# EAGLE design amp_board (EAGLE 9.6.0)
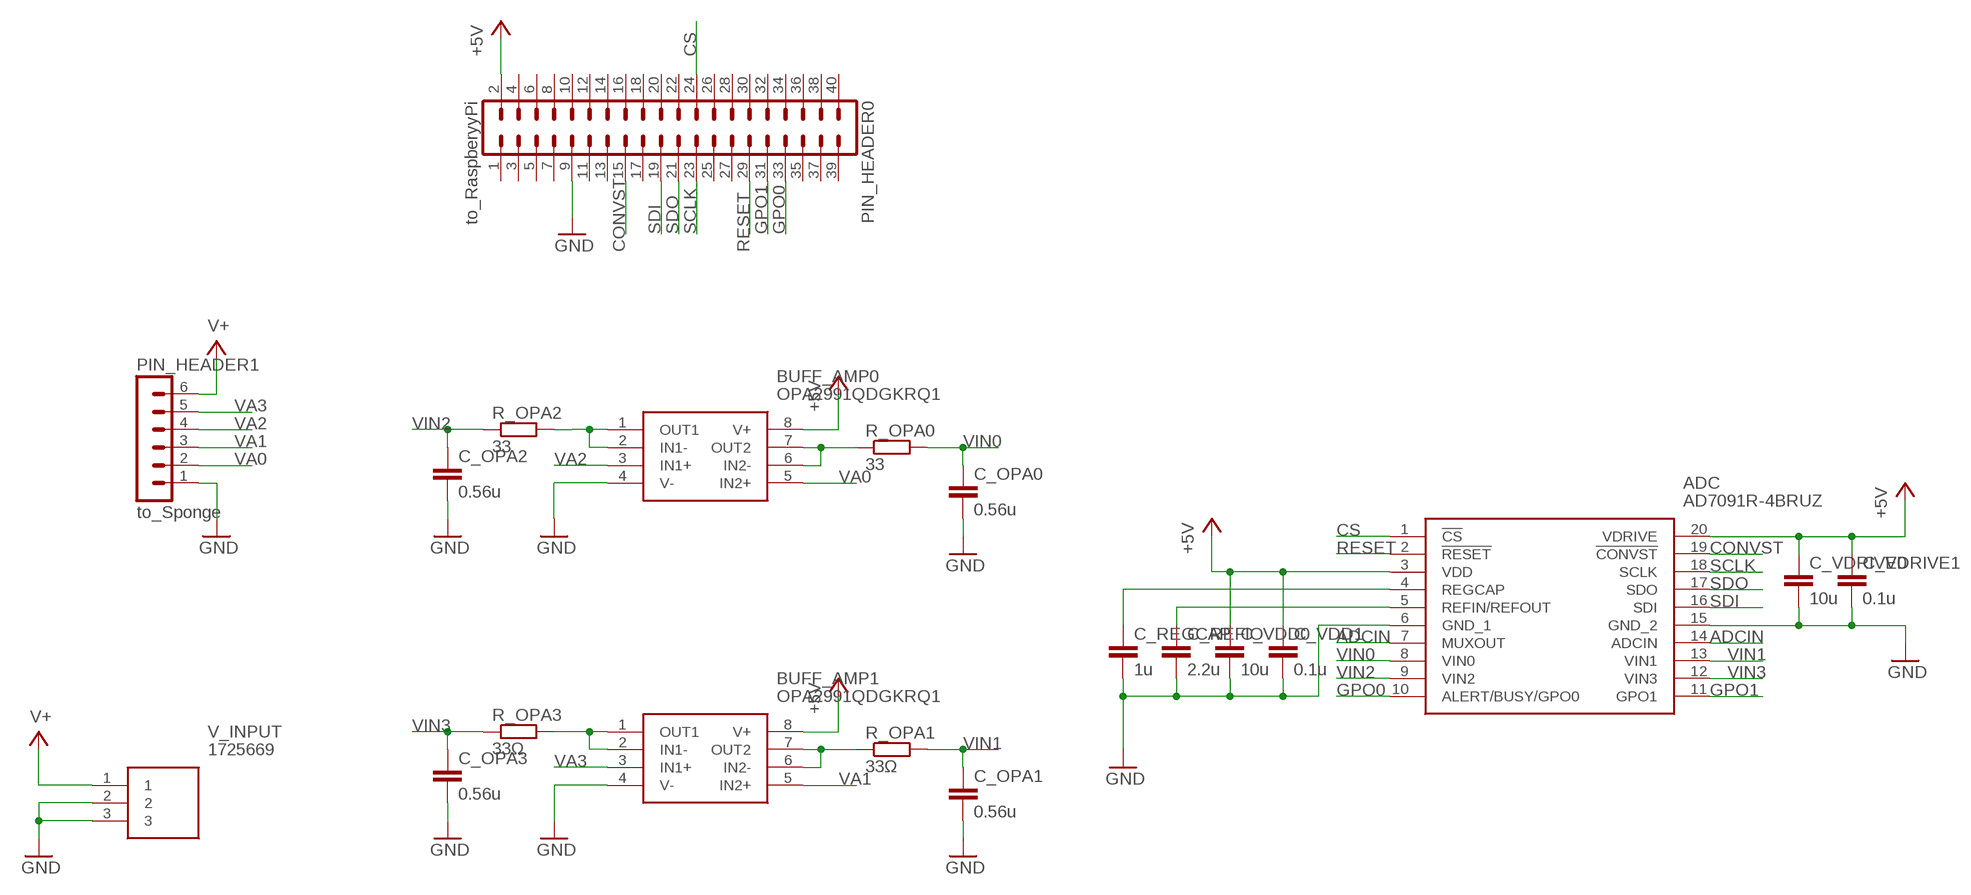
[diagram p0: schematic, sheet 1]

## Parts
ADC  AD7091R-4BRUZ  [SOP65P640X120-20N]
BUFF_AMP0  OPA2991QDGKRQ1  [SOP65P490X110-8N]
BUFF_AMP1  OPA2991QDGKRQ1  [SOP65P490X110-8N]
C_OPA0  0.56u  C-EUC0805  [C0805]
C_OPA1  0.56u  C-EUC0805  [C0805]
C_OPA2  0.56u  C-EUC0805  [C0805]
C_OPA3  0.56u  C-EUC0805  [C0805]
C_REFIO  2.2u  C-EUC0805  [C0805]
C_REGCAP  1u  C-EUC0805  [C0805]
C_VDD0  10u  C-EUC0805  [C0805]
C_VDD1  0.1u  C-EUC0805  [C0805]
C_VDRIVE0  10u  C-EUC0805  [C0805]
C_VDRIVE1  0.1u  C-EUC0805  [C0805]
PIN_HEADER0  to_RaspberyyPi  MA20-2  [MA20-2]
PIN_HEADER1  to_Sponge  MA06-1  [MA06-1]
R_OPA0  33  R-EU_R1206  [R1206]
R_OPA1  33Ω  R-EU_R1206  [R1206]
R_OPA2  33  R-EU_R1206  [R1206]
R_OPA3  33Ω  R-EU_R1206  [R1206]
V_INPUT  1725669  [1725669]

## Nets
+5V: ADC.3(VDD) ADC.20(VDRIVE) BUFF_AMP0.8(V+) BUFF_AMP1.8(V+) C_VDD0.1 C_VDD1.1 C_VDRIVE0.1 C_VDRIVE1.1 PIN_HEADER0.2
ADCIN: ADC.7(MUXOUT) ADC.14(ADCIN)
CONVST: ADC.19(!CONVST) PIN_HEADER0.15
CS: ADC.1(!CS) PIN_HEADER0.24
GND: ADC.6(GND_1) ADC.15(GND_2) BUFF_AMP0.4(V-) BUFF_AMP1.4(V-) C_OPA0.2 C_OPA1.2 C_OPA2.2 C_OPA3.2 C_REFIO.2 C_REGCAP.2 C_VDD0.2 C_VDD1.2 C_VDRIVE0.2 C_VDRIVE1.2 PIN_HEADER0.9 PIN_HEADER1.1 V_INPUT.2 V_INPUT.3
GPO0: ADC.10(ALERT/BUSY/GPO0) PIN_HEADER0.33
GPO1: ADC.11(GPO1) PIN_HEADER0.31
N$1: BUFF_AMP0.1(OUT1) BUFF_AMP0.2(IN1-) R_OPA2.2
N$3: BUFF_AMP1.6(IN2-) BUFF_AMP1.7(OUT2) R_OPA1.1
N$4: BUFF_AMP1.1(OUT1) BUFF_AMP1.2(IN1-) R_OPA3.2
N$6: BUFF_AMP0.6(IN2-) BUFF_AMP0.7(OUT2) R_OPA0.1
N$9: ADC.4(REGCAP) C_REGCAP.1
N$10: ADC.5(REFIN/REFOUT) C_REFIO.1
RESET: ADC.2(!RESET) PIN_HEADER0.29
SCLK: ADC.18(SCLK) PIN_HEADER0.23
SDI: ADC.16(SDI) PIN_HEADER0.19
SDO: ADC.17(SDO) PIN_HEADER0.21
V+: PIN_HEADER1.6 V_INPUT.1
VA0: BUFF_AMP0.5(IN2+) PIN_HEADER1.2
VA1: BUFF_AMP1.5(IN2+) PIN_HEADER1.3
VA2: BUFF_AMP0.3(IN1+) PIN_HEADER1.4
VA3: BUFF_AMP1.3(IN1+) PIN_HEADER1.5
VIN0: ADC.8(VIN0) C_OPA0.1 R_OPA0.2
VIN1: ADC.13(VIN1) C_OPA1.1 R_OPA1.2
VIN2: ADC.9(VIN2) C_OPA2.1 R_OPA2.1
VIN3: ADC.12(VIN3) C_OPA3.1 R_OPA3.1
Unconnected: PIN_HEADER0.1 PIN_HEADER0.3 PIN_HEADER0.4 PIN_HEADER0.5 PIN_HEADER0.6 PIN_HEADER0.7 PIN_HEADER0.8 PIN_HEADER0.10 PIN_HEADER0.11 PIN_HEADER0.12 PIN_HEADER0.13 PIN_HEADER0.14 PIN_HEADER0.16 PIN_HEADER0.17 PIN_HEADER0.18 PIN_HEADER0.20 PIN_HEADER0.22 PIN_HEADER0.25 PIN_HEADER0.26 PIN_HEADER0.27 PIN_HEADER0.28 PIN_HEADER0.30 PIN_HEADER0.32 PIN_HEADER0.34 PIN_HEADER0.35 PIN_HEADER0.36 PIN_HEADER0.37 PIN_HEADER0.38 PIN_HEADER0.39 PIN_HEADER0.40

## Library data of the parts
ADC = SamacSys_Parts:AD7091R-4BRUZ: Analog Devices AD7091R-4BRUZ, 12-bit Serial ADC 4-Channel, 20-Pin TSSOP Source: Datasheet <http://uk.rs-online.com/web/p/products/8107727P>; DESCRIPTION: Analog Devices AD7091R-4BRUZ, 12-bit Serial ADC 4-Channel, 20-Pin TSSOP; HEIGHT: 1.2mm; MANUFACTURER_NAME: Analog Devices; MANUFACTURER_PART_NUMBER: AD7091R-4BRUZ; RS_PART_NUMBER: 8107727P; RS_PRICE-STOCK: http://uk.rs-online.com/web/p/products/8107727P
BUFF_AMP0 BUFF_AMP1 = SamacSys_Parts:OPA2991QDGKRQ1: Operational Amplifiers - Op Amps Automotive 2-channel, 40-V rail-to-rail input/output, low offset voltage, low noise op amp 8-VSSOP -40 to 125 Source: Datasheet <https://www.ti.com/lit/gpn/opa2991-q1>; DESCRIPTION: Operational Amplifiers - Op Amps Automotive&nbsp;2-channel, 40-V rail-to-rail input/output, low offset voltage, low noise op amp 8-VSSOP -40 to 125; HEIGHT: 1.1mm; MANUFACTURER_NAME: Texas Instruments; MANUFACTURER_PART_NUMBER: OPA2991QDGKRQ1
C_OPA0 C_OPA1-C_OPA3 C_REFIO C_REGCAP C_VDD0 C_VDD1 C_VDRIVE0 C_VDRIVE1 = rcl:C-EU: CAPACITOR, European symbol; SPICEPREFIX: C
PIN_HEADER0 = con-lstb:MA20-2: PIN HEADER; OC_FARNELL: unknown; OC_NEWARK: unknown
PIN_HEADER1 = con-lstb:MA06-1: PIN HEADER; OC_FARNELL: unknown; OC_NEWARK: unknown
R_OPA0 R_OPA1-R_OPA3 = rcl:R-EU_: RESISTOR, European symbol; SPICEPREFIX: R
V_INPUT = 1725669:1725669: 3 way PCB vertical mount terminal,2.54mm 3 way PCB vertical mount terminal,2.54mm Source: Datasheet <https://www.phoenixcontact.com/online/portal/gb?uri=pxc-oc-itemdetail:pid=1725669&library=gben&tab=1>; ARROW_PART_NUMBER: 1725669; ARROW_PRICE-STOCK: https://www.arrow.com/en/products/1725669/phoenix-contact?region=nac; DESCRIPTION: 3 way PCB vertical mount terminal,2.54mm 3 way PCB vertical mount terminal,2.54mm; HEIGHT: 8.5mm; MANUFACTURER_NAME: Phoenix Contact; MANUFACTURER_PART_NUMBER: 1725669; MOUSER_PART_NUMBER: 651-1725669; MOUSER_PRICE-STOCK: https://www.mouser.co.uk/ProductDetail/Phoenix-Contact/1725669?qs=A%2FKWGUWTCZjmkTL0Oe91ew%3D%3D

## Board
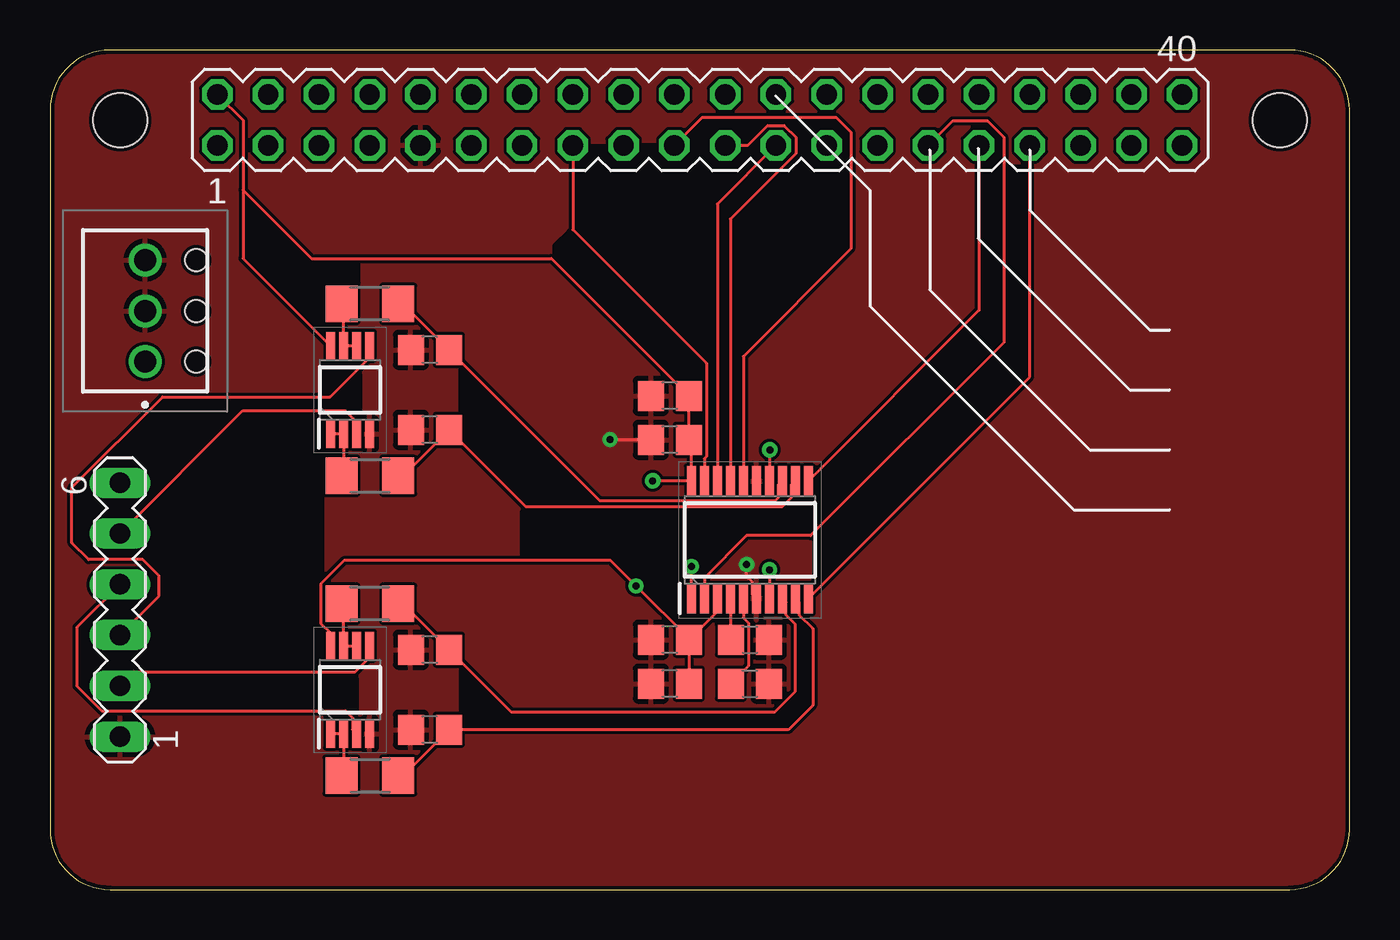
[diagram p1: board, top side]
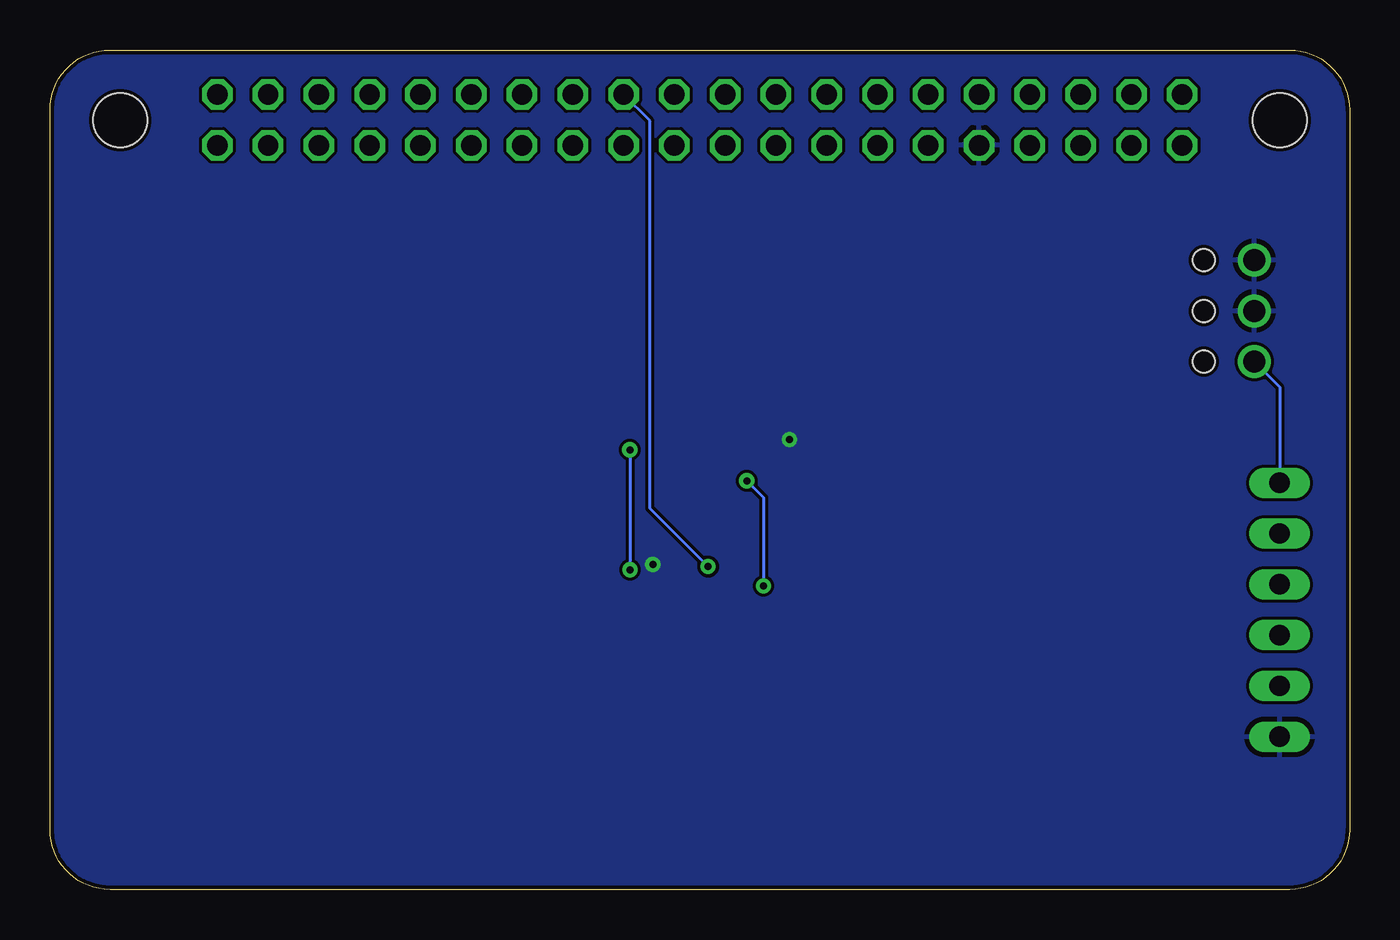
[diagram p2: board, bottom side, seen from below]

Size 65 x 42 mm. Coordinates in mm from the lower left corner, seen from the top.
Outline: 65,3 65,39 arc90 62,42 3,42 arc90 0,39 0,3 arc90 3,0 62,0 arc90 65,3
Copper layers (1*16): Top 0.035mm / dielectric 1.5mm / Bottom 0.035mm
Design rules "PCBGoGo": minimum track width 6mil, minimum drill 0.2mm, track to track 6mil, track to pad 6mil, pad to pad 6mil, via to via 6mil, smd to smd 6mil, copper to edge 0.2mm, drill to drill 6mil, minimum pad ring 10mil, minimum via ring 8mil, stop-mask expansion 4mil, vias tented up to drill 0mil, thermal gap 10mil
Holes 2.7 mm at 3.5,38.5 61.5,38.5
tRestrict: 18 lines

### Footprints (pad centres in the part's own frame; a part is rotated, then mirrored left to right if it is on the bottom)
SOP65P640X120-20N = smd 1.475 x 0.45: 1 -2.938,2.925; 2 -2.938,2.275; 3 -2.938,1.625; 4 -2.938,0.975; 5 -2.938,0.325; 6 -2.938,-0.325; 7 -2.938,-0.975; 8 -2.938,-1.625; 9 -2.938,-2.275; 10 -2.938,-2.925; 11 2.938,-2.925; 12 2.938,-2.275; 13 2.938,-1.625; 14 2.938,-0.975; 15 2.938,-0.325; 16 2.938,0.325; 17 2.938,0.975; 18 2.938,1.625; 19 2.938,2.275; 20 2.938,2.925
SOP65P490X110-8N = smd 1.4 x 0.45: 1 -2.2,0.975; 2 -2.2,0.325; 3 -2.2,-0.325; 4 -2.2,-0.975; 5 2.2,-0.975; 6 2.2,-0.325; 7 2.2,0.325; 8 2.2,0.975
C0805 = smd 1.3 x 1.5: 1 -0.95,0; 2 0.95,0
MA20-2 = drill 1.016 octagon: 1 -24.13,-1.27; 2 -24.13,1.27; 3 -21.59,-1.27; 4 -21.59,1.27; 5 -19.05,-1.27; 6 -19.05,1.27; 7 -16.51,-1.27; 8 -16.51,1.27; 9 -13.97,-1.27; 10 -13.97,1.27; 11 -11.43,-1.27; 12 -11.43,1.27; 13 -8.89,-1.27; 14 -8.89,1.27; 15 -6.35,-1.27; 16 -6.35,1.27; 17 -3.81,-1.27; 18 -3.81,1.27; 19 -1.27,-1.27; 20 -1.27,1.27; 21 1.27,-1.27; 22 1.27,1.27; 23 3.81,-1.27; 24 3.81,1.27; 25 6.35,-1.27; 26 6.35,1.27; 27 8.89,-1.27; 28 8.89,1.27; 29 11.43,-1.27; 30 11.43,1.27; 31 13.97,-1.27; 32 13.97,1.27; 33 16.51,-1.27; 34 16.51,1.27; 35 19.05,-1.27; 36 19.05,1.27; 37 21.59,-1.27; 38 21.59,1.27; 39 24.13,-1.27; 40 24.13,1.27
MA06-1 = drill 1.016 long: 1 -6.35,0; 2 -3.81,0; 3 -1.27,0; 4 1.27,0; 5 3.81,0; 6 6.35,0
R1206 = smd 1.6 x 1.803: 1 -1.422,0; 2 1.422,0
1725669 = drill 1.1 pad 1.65: 1 0,0; 2 2.54,0; 3 5.08,0 | hole 1.1: 0,-2.54; 2.54,-2.54; 5.08,-2.54

### Placement (x,y rotation side)
ADC  35,17.5 90 top
BUFF_AMP0  15,10 90 top
BUFF_AMP1  15,25 90 top
C_OPA0  19,12 180 top
C_OPA1  19,27 180 top
C_OPA2  19,8 180 top
C_OPA3  19,23 180 top
C_REFIO  35,10.3 0 top
C_REGCAP  35,12.5 0 top
C_VDD0  31,24.7 180 top
C_VDD1  31,22.5 180 top
C_VDRIVE0  31,10.3 180 top
C_VDRIVE1  31,12.5 180 top
PIN_HEADER0  32.5,38.5 0 top
PIN_HEADER1  3.5,14 90 top
R_OPA0  16,14.3 0 top
R_OPA1  16,29.3 0 top
R_OPA2  16,5.7 180 top
R_OPA3  16,20.7 180 top
V_INPUT  4.76,26.41 90 top

### Tracks (layer width: path | path; a pad name or v marks a point on that pad's centre or on a via)
+5V  (via drill 0.35)
  Top 0.152: PIN_HEADER0.2 9.65,38.49 9.65,35 | BUFF_AMP1.8 9.65,31.57 9.65,35 | ADC.3 33.38,13.93 C_VDRIVE1.1 | C_VDRIVE1.1 C_VDRIVE0.1 | v30.15,20.45 30.18,20.42 30.19,20.44 ADC.20 32.08,22.38 C_VDD1.1 C_VDD0.1 25.08,31.57 13.08,31.57 9.65,35 | C_VDRIVE1.1 31.95,12.55 v29.31,15.19 28.04,16.46 14.71,16.46 13.55,15.3 13.55,13.3 14.03,12.83 BUFF_AMP0.8
  Bottom 0.152: v30.15,20.45 29.31,19.61 v29.31,15.19
ADCIN  (via drill 0.35)
  Top 0.152: ADC.14 36,20.46 v36,22 | v35.99,16 35.99,14.58 ADC.7
  Bottom 0.152: v36,22 v36,16 v35.99,16
CONVST
  Top 0.152: PIN_HEADER0.15 26.15,33.01 32.83,26.33 32.83,21.66 32.73,21.55 ADC.19
CS  (via drill 0.35)
  Top 0.152: ADC.1 v32.08,16.15
  Bottom 0.152: v32.08,16.15 35,19.07 35,38.46 PIN_HEADER0.24
GND  (via drill 0.35)
  Top 0.152: C_VDD1.2 v28.02,22.5 | ADC.6 35.13,14.76 35.13,15.39 34.85,15.67 v34.85,16.26
  Bottom 0.152: v28.02,22.5 28.02,22.53 | v34.85,16.26 34.82,16.26
  pour Top: -5,61 -5,-4 69,-4 69,62 -5,62
  pour Bottom: -2,44 -2,-2 67,-2 67,44
GPO0
  Top 0.152: ADC.10 49.01,25.65 PIN_HEADER0.33
GPO1
  Top 0.152: PIN_HEADER0.31 46.47,28.98 ADC.11
N$1
  Top 0.152: BUFF_AMP0.1 BUFF_AMP0.2 14.68,5.8 R_OPA2.2
N$3
  Top 0.152: BUFF_AMP1.6 BUFF_AMP1.7 14.68,29.2 R_OPA1.1
N$4
  Top 0.152: BUFF_AMP1.1 BUFF_AMP1.2 14.68,20.8 R_OPA3.2
N$6
  Top 0.152: BUFF_AMP0.6 BUFF_AMP0.7 14.68,14.2 R_OPA0.1
N$9
  Top 0.152: ADC.4 34.02,12.53 C_REGCAP.1
N$10
  Top 0.152: ADC.5 34.67,13.6 34.93,13.35 34.93,11.18 C_REFIO.1
RESET
  Top 0.152: PIN_HEADER0.29 45.16,38.46 46.89,38.46 47.7,37.64 47.7,27.36 38.05,17.7 34.85,17.7 32.73,15.58 ADC.2
SCLK
  Top 0.152: PIN_HEADER0.23 33.38,34.3 ADC.18
SDI
  Top 0.152: PIN_HEADER0.19 32.63,38.63 39.32,38.63 40.06,37.9 40.06,32.06 34.67,26.68 ADC.16
SDO
  Top 0.152: ADC.17 34.02,33.54 37.3,36.82 37.3,37.64 36.72,38.22 35.9,38.22 34.91,37.23 PIN_HEADER0.21
V+
  Bottom 0.152: V_INPUT.1 3.5,25.15 PIN_HEADER1.6
VA0
  Top 0.152: PIN_HEADER1.2 4.21,10.9 15.27,10.9 15.97,11.6 BUFF_AMP0.5
VA1
  Top 0.152: PIN_HEADER1.3 5.46,14.69 5.46,15.7 4.65,16.51 1.93,16.51 1.09,17.35 1.09,20.11 5.62,24.64 14.01,24.64 15.97,26.6 BUFF_AMP1.5
VA2
  Top 0.152: PIN_HEADER1.4 1.35,13.12 1.35,10.18 2.59,8.94 14.78,8.94 15.13,8.6 15.13,8 BUFF_AMP0.3
VA3
  Top 0.152: PIN_HEADER1.5 9.64,23.95 14.77,23.95 15.32,23.4 BUFF_AMP1.3
VIN0
  Top 0.152: R_OPA0.2 17.65,14.3 C_OPA0.1 23.06,8.89 36.26,8.89 37.29,9.91 37.29,13.26 36.82,13.73 36.82,14.37 ADC.8
VIN1
  Top 0.152: R_OPA1.2 17.65,29.3 C_OPA1.1 27.48,19.47 36.3,19.47 36.43,19.61 36.43,20.24 ADC.13
VIN2
  Top 0.152: R_OPA2.1 17.65,5.7 C_OPA2.1 36.93,8 38.15,9.22 38.15,13.05 37.47,13.73 37.47,14.37 ADC.9
VIN3
  Top 0.152: R_OPA3.1 17.65,20.7 C_OPA3.1 23.78,19.17 36.64,19.17 37.08,19.61 37.08,20.24 ADC.12

### Text on the board
Document: CONVST | SDI | SDO | SCLK | 33 | GPIO0 | 0.56u | 10u | V+ | GPIO1 | 0.1u | 0.56u | RESET | 33 | CS | 33 | 0.56u | 1u | 0.1u | 2.2u | 0.56u | 10u | 33 | Ikemoto Lab | designed by GOTO